# EAGLE design TH555-IO (EAGLE 7.5.0)
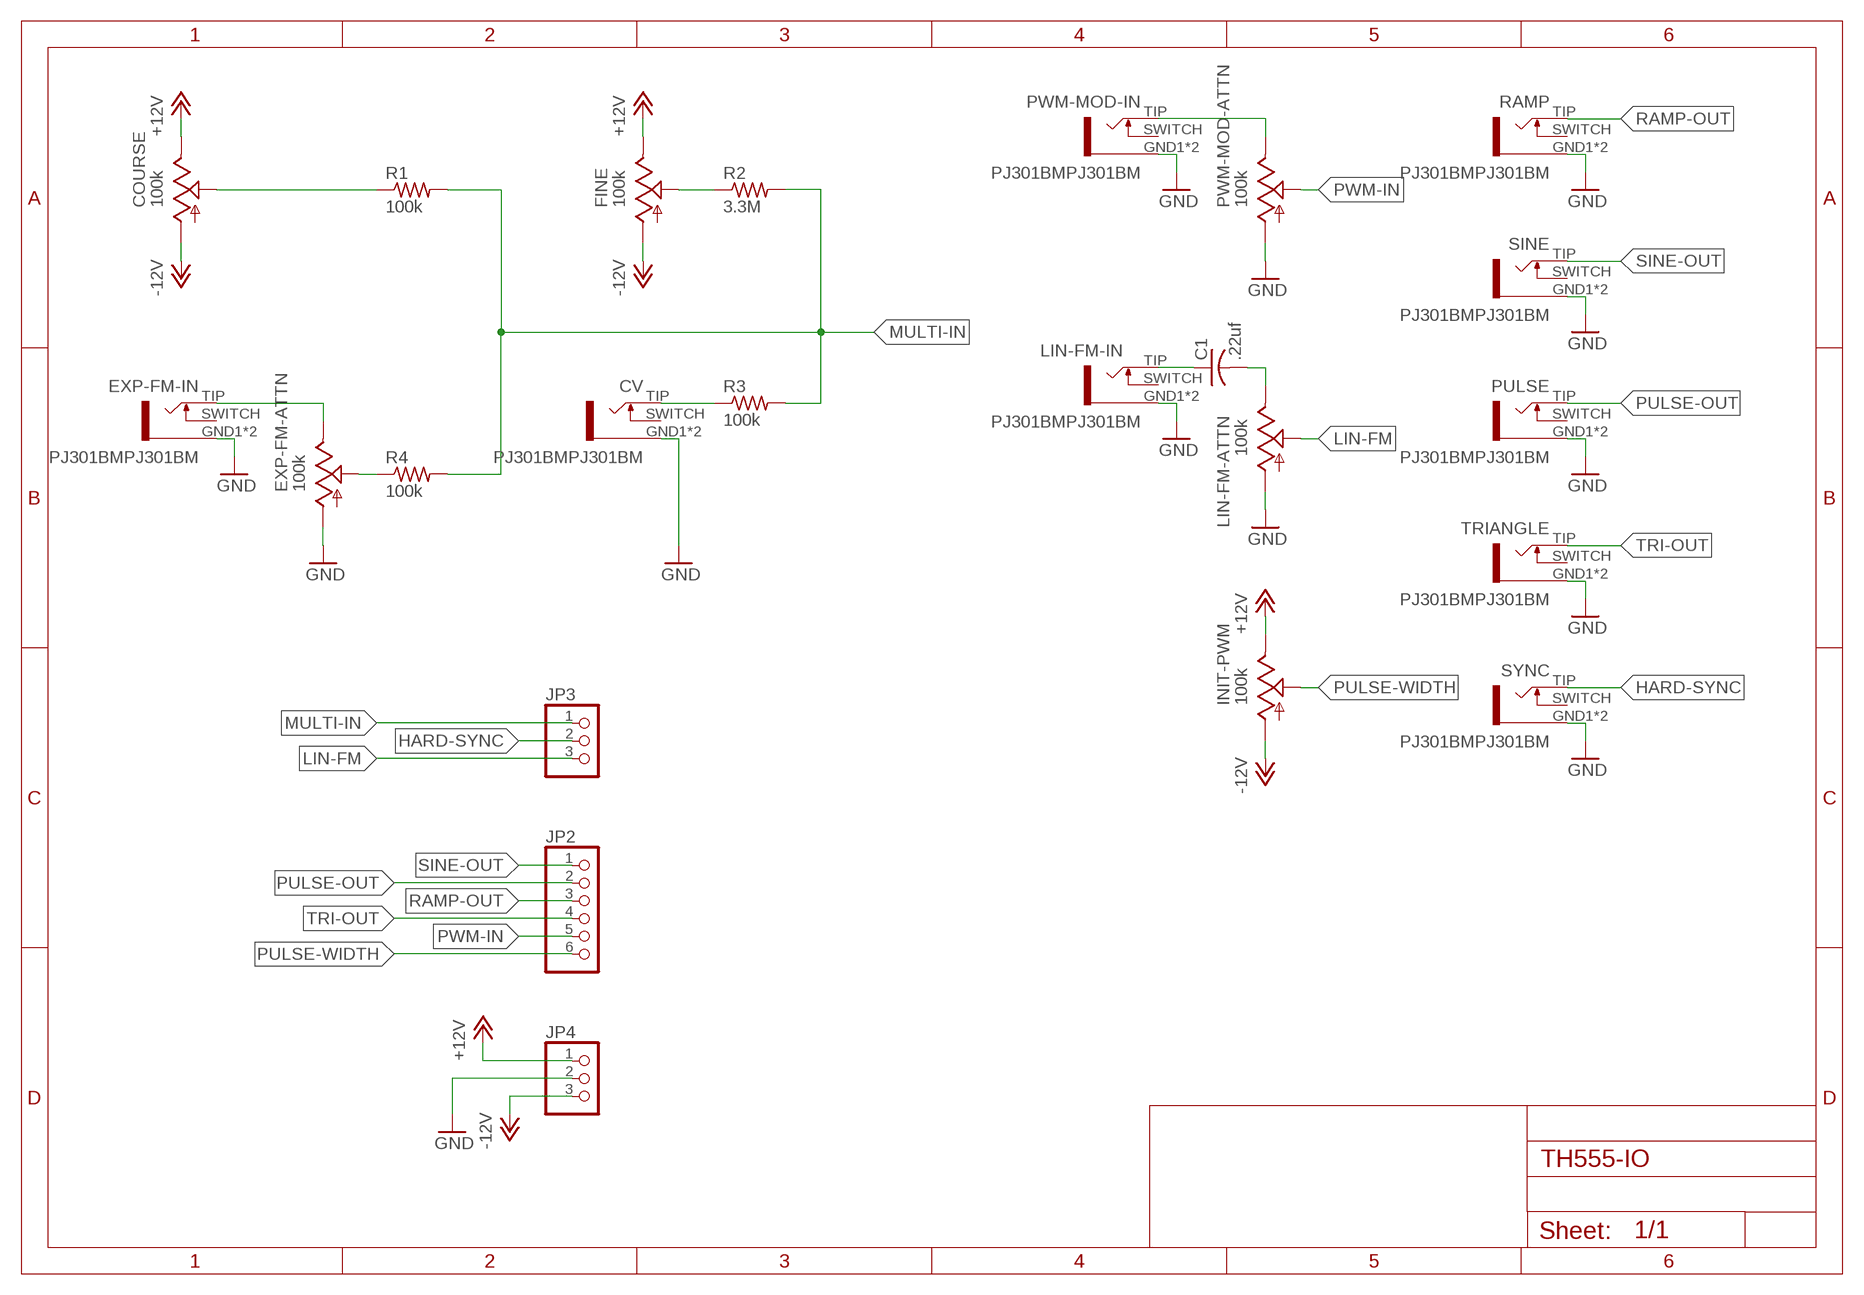
[diagram p0: schematic, sheet 1]

## Parts
C1  .22uf  C-US050-024X044  [C050-024X044]
COURSE  100k  ALPHA-9MMA  [EVUF]
CV  PJ301BMPJ301BM  [PJ301BM]
EXP-FM-ATTN  100k  ALPHA-9MMA  [EVUF]
EXP-FM-IN  PJ301BMPJ301BM  [PJ301BM]
FINE  100k  ALPHA-9MMA  [EVUF]
INIT-PWM  100k  ALPHA-9MMA  [EVUF]
JP2  PINHD-1X6  [1X06]
JP3  PINHD-1X3  [1X03]
JP4  PINHD-1X3  [1X03]
LIN-FM-ATTN  100k  ALPHA-9MMA  [EVUF]
LIN-FM-IN  PJ301BMPJ301BM  [PJ301BM]
PULSE  PJ301BMPJ301BM  [PJ301BM]
PWM-MOD-ATTN  100k  ALPHA-9MMA  [EVUF]
PWM-MOD-IN  PJ301BMPJ301BM  [PJ301BM]
R1  100k  R-US_0207/10  [0207/10]
R2  3.3M  R-US_0207/10  [0207/10]
R3  100k  R-US_0207/10  [0207/10]
R4  100k  R-US_0207/10  [0207/10]
RAMP  PJ301BMPJ301BM  [PJ301BM]
SINE  PJ301BMPJ301BM  [PJ301BM]
SYNC  PJ301BMPJ301BM  [PJ301BM]
TRIANGLE  PJ301BMPJ301BM  [PJ301BM]

## Nets
1V/OCT: CV.TIP R3.1
+12V: COURSE.3(E) FINE.3(E) INIT-PWM.3(E) JP4.1
-12V: COURSE.1(A) FINE.1(A) INIT-PWM.1(A) JP4.3
COARSE: COURSE.2(S) R1.1
EXP-FM: EXP-FM-ATTN.3(E) EXP-FM-IN.TIP
EXP-FM-ATTN: EXP-FM-ATTN.2(S) R4.1
FINE: FINE.2(S) R2.1
GND: CV.GND1 CV.GND2 EXP-FM-ATTN.1(A) EXP-FM-IN.GND1 EXP-FM-IN.GND2 JP4.2 LIN-FM-ATTN.1(A) LIN-FM-IN.GND1 LIN-FM-IN.GND2 PULSE.GND1 PULSE.GND2 PWM-MOD-ATTN.1(A) PWM-MOD-IN.GND1 PWM-MOD-IN.GND2 RAMP.GND1 RAMP.GND2 SINE.GND1 SINE.GND2 SYNC.GND1 SYNC.GND2 TRIANGLE.GND1 TRIANGLE.GND2
HARD-SYNC: JP3.2 SYNC.TIP
LIN-FM: JP3.3 LIN-FM-ATTN.2(S)
MULTI-IN: JP3.1 R1.2 R2.2 R3.2 R4.2
N$2: PWM-MOD-ATTN.3(E) PWM-MOD-IN.TIP
N$6: C1.2 LIN-FM-ATTN.3(E)
N$8: C1.1 LIN-FM-IN.TIP
PULSE-OUT: JP2.2 PULSE.TIP
PULSE-WIDTH: INIT-PWM.2(S) JP2.6
PWM-IN: JP2.5 PWM-MOD-ATTN.2(S)
RAMP-OUT: JP2.3 RAMP.TIP
SINE-OUT: JP2.1 SINE.TIP
TRI-OUT: JP2.4 TRIANGLE.TIP
Unconnected: CV.SWITCH EXP-FM-IN.SWITCH LIN-FM-IN.SWITCH PULSE.SWITCH PWM-MOD-IN.SWITCH RAMP.SWITCH SINE.SWITCH SYNC.SWITCH TRIANGLE.SWITCH

## Library data of the parts
C1 = resistor:C-US: CAPACITOR, American symbol
COURSE EXP-FM-ATTN FINE INIT-PWM LIN-FM-ATTN PWM-MOD-ATTN = TomW:ALPHA-9MM: 9 mm Square Rotary Potentiometers Source: Panasonic
CV EXP-FM-IN LIN-FM-IN PULSE PWM-MOD-IN RAMP SINE SYNC TRIANGLE = gerbster:PJ301BM
JP2 = pinhead:PINHD-1X6: PIN HEADER
JP3 JP4 = pinhead:PINHD-1X3: PIN HEADER
R1-R4 = resistor:R-US_: RESISTOR, American symbol

## Board
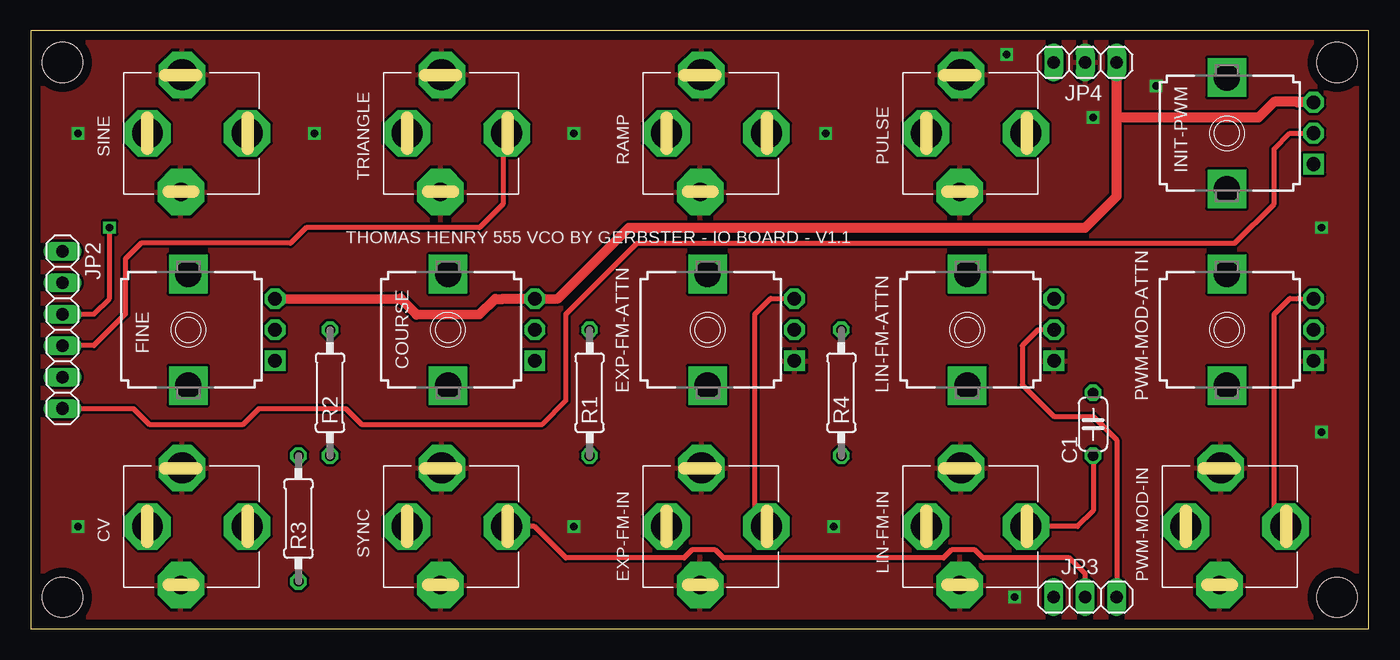
[diagram p1: board, top side]
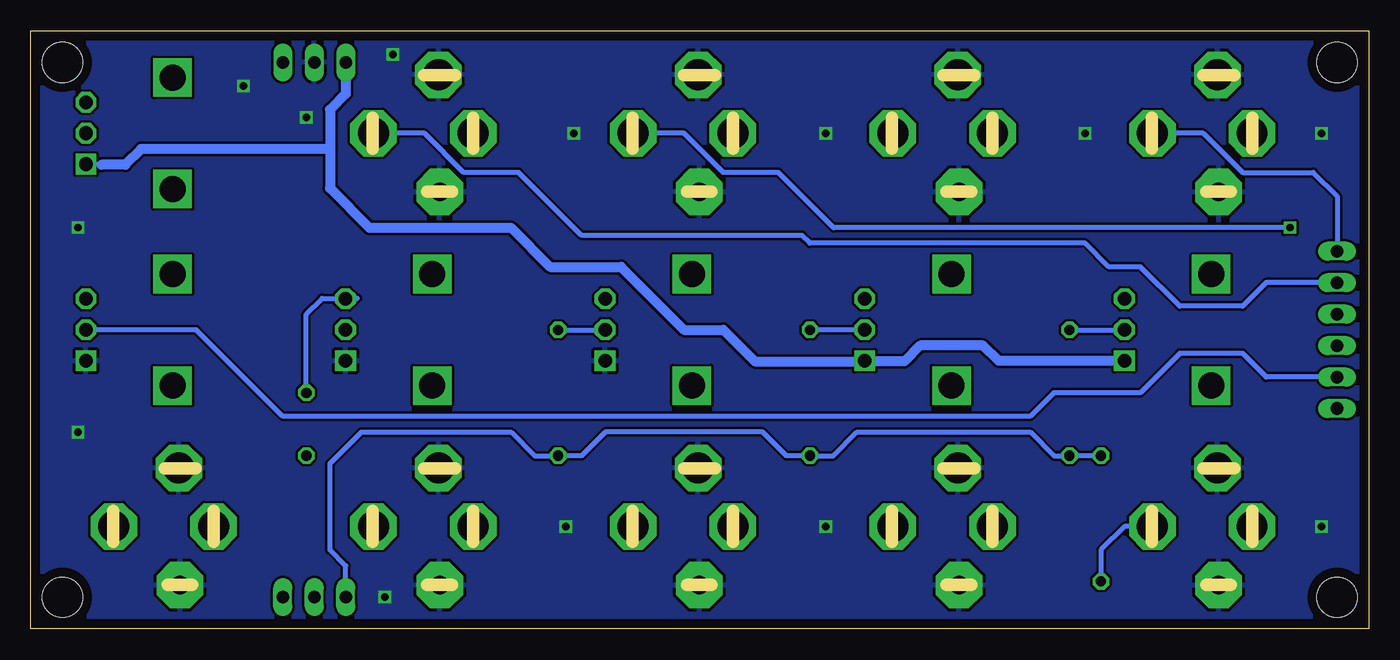
[diagram p2: board, bottom side, seen from below]

Size 107.95 x 48.26 mm. Coordinates in mm from the lower left corner, seen from the top.
Outline: 107.95,0 107.95,48.26 0,48.26 0,0 107.95,0
Copper layers (1*16): Top 0.035mm / dielectric 1.5mm / Bottom 0.035mm
Design rules "PCBWay": minimum track width 10mil, minimum drill 6mil, track to track 8mil, track to pad 8mil, pad to pad 8mil, via to via 8mil, smd to smd 8mil, copper to edge 30mil, drill to drill 8mil, minimum pad ring 10mil, minimum via ring 8mil, stop-mask expansion 4mil, vias tented up to drill 0mil, thermal gap 10mil
Holes 3.21 mm at 2.54,45.72 2.54,2.54 105.41,2.54 105.41,45.72

### Footprints (pad centres in the part's own frame; a part is rotated, then mirrored left to right if it is on the bottom)
C050-024X044 = drill 0.813 octagon: 1 -2.54,0; 2 2.54,0
EVUF = drill 1.1 pad 1.676 square: 1 -2.5,-7 | drill 1.1 pad 1.676 octagon: 2 0,-7; 3 2.5,-7 | drill 2.1 pad 2.8 square: M1 4.5,0; M2 -4.5,0
PJ301BM = drill 2.5 pad 3.75 octagon: GND1 -4.719,-0.5; SWITCH 0,-3.3; TIP 0,4.746 | drill 1.5 pad 3.75 octagon: GND2 4.746,-0.6
1X06 = drill 1.016 long: 1 -6.35,0; 2 -3.81,0; 3 -1.27,0; 4 1.27,0; 5 3.81,0; 6 6.35,0
1X03 = drill 1.016 long: 1 -2.54,0; 2 0,0; 3 2.54,0
0207/10 = drill 0.813 octagon: 1 -5.08,0; 2 5.08,0

### Placement (x,y rotation side)
C1  85.72,16.51 90 top
COURSE  33.66,24.13 90 top
CV  12.7,8.26 270 top
EXP-FM-ATTN  54.61,24.13 90 top
EXP-FM-IN  54.61,8.26 270 top
FINE  12.7,24.13 90 top
INIT-PWM  96.52,40.01 90 top
JP2  2.54,24.13 270 top
JP3  85.09,2.54 0 top
JP4  85.09,45.72 180 top
LIN-FM-ATTN  75.56,24.13 90 top
LIN-FM-IN  75.56,8.26 270 top
PULSE  75.56,40.01 270 top
PWM-MOD-ATTN  96.52,24.13 90 top
PWM-MOD-IN  96.52,8.26 270 top
R1  45.09,19.05 270 top
R2  24.13,19.05 270 top
R3  21.59,8.89 90 top
R4  65.41,19.05 270 top
RAMP  54.61,40.01 270 top
SINE  12.7,40.01 270 top
SYNC  33.66,8.26 270 top
TRIANGLE  33.66,40.01 270 top

### Tracks (layer width: path | path; a pad name or v marks a point on that pad's centre or on a via)
1V/OCT
  Bottom 0.406: CV.TIP 19.68,8.26 21.59,6.35 R3.1
+12V
  Top 0.813: INIT-PWM.3 102.23,42.51 102.23,42.55 100.33,42.55 99.06,41.27 87.63,41.27 | FINE.3 29.84,26.67 31.11,25.36 36.2,25.4 37.47,26.63 38.1,26.63 | COURSE.3 38.1,26.63 | 38.1,26.63 42.55,26.67 48.26,32.38 85.09,32.38 87.63,34.92 87.63,41.27 | 87.63,41.27 JP4.1
-12V
  Bottom 0.406: 102.25,37.47 INIT-PWM.1 | 40.34,21.59 COURSE.1
  Bottom 0.813: JP4.3 82.55,43.18 83.82,41.91 83.82,38.73 | 83.82,38.73 99.06,38.73 100.33,37.47 102.25,37.47 | 83.82,38.73 83.82,35.56 80.64,32.38 69.22,32.38 66.04,29.21 60.33,29.21 55.24,24.13 52.07,24.13 49.53,21.59 40.34,21.59 37.47,21.59 36.2,22.86 31.11,22.86 29.84,21.63 FINE.1
COARSE
  Bottom 0.406: COURSE.2 R1.1
EXP-FM
  Top 0.406: EXP-FM-IN.TIP 58.42,8.89 58.42,25.4 59.69,26.67 60.98,26.67 EXP-FM-ATTN.3
EXP-FM-ATTN
  Bottom 0.406: R4.1 EXP-FM-ATTN.2
FINE
  Bottom 0.406: R2.1 FINE.2
GND  (via drill 0.6)
  other vias: 3.81,8.26 78.74,46.35 79.38,2.54 90.81,43.81 64.14,40.01 64.77,8.26 43.81,8.26 43.81,40.01 22.86,40.01 85.72,41.27 3.81,40.01 104.14,32.38 104.14,15.88
  pour Bottom: 0,48.26 0,0 107.95,0 107.95,48.26
  pour Top: 0,48.26 0,0 107.95,0 107.95,48.26
HARD-SYNC
  Top 0.406: JP3.2 85.09,4.45 83.82,5.71 76.83,5.71 76.2,6.35 74.3,6.35 73.66,5.71 55.88,5.71 55.24,6.35 53.34,6.35 52.7,5.71 43.18,5.71 40.64,8.26 SYNC.TIP
LIN-FM  (1 unrouted)
  Top 0.406: LIN-FM-ATTN.2 81.28,24.13 80.01,22.86 80.01,19.68 82.55,17.14 85.72,17.14 87.63,15.24 JP3.3
MULTI-IN
  Bottom 0.406: R3.2 R2.2 25.4,13.97 27.3,15.88 41.27,15.88 43.18,13.97 R1.2 46.99,13.97 48.9,15.88 61.59,15.88 63.5,13.97 R4.2 67.31,13.97 69.22,15.88 81.28,15.88 83.82,13.34 83.82,6.35 82.55,5.08 JP3.1
N$2
  Top 0.406: PWM-MOD-IN.TIP 100.33,8.89 100.33,25.4 101.6,26.67 102.25,26.67 PWM-MOD-ATTN.3
N$6
  Bottom 0.406: C1.2 85.72,25.4 84.45,26.67 81.61,26.67 LIN-FM-ATTN.3
N$8
  Top 0.406: C1.1 85.72,9.53 84.45,8.26 LIN-FM-IN.TIP
PULSE-OUT
  Bottom 0.406: JP2.2 8.26,27.94 10.16,26.04 15.24,26.04 18.41,29.21 20.95,29.21 22.86,31.11 45.09,31.11 45.72,31.75 63.5,31.75 68.58,36.83 73.03,36.83 76.2,40.01 PULSE.TIP
PULSE-WIDTH
  Top 0.406: JP2.6 8.26,17.78 9.53,16.51 17.14,16.51 18.41,17.78 25.4,17.78 26.67,16.51 41.27,16.51 43.18,18.41 43.18,25.4 48.9,31.11 97.16,31.11 100.33,34.29 100.33,38.73 101.6,40.01 INIT-PWM.2
PWM-IN
  Bottom 0.406: JP2.5 8.26,20.32 10.16,22.23 15.24,22.23 18.41,19.05 25.4,19.05 27.3,17.14 87.63,17.14 94.61,24.13 PWM-MOD-ATTN.2
RAMP-OUT  (via drill 0.6)
  Top 0.406: JP2.3 5.08,25.4 6.35,26.67 v6.35,32.38
  Bottom 0.406: v6.35,32.38 43.18,32.38 47.62,36.83 52.07,36.83 55.24,40.01 RAMP.TIP
SINE-OUT
  Bottom 0.406: JP2.1 2.54,34.92 4.45,36.83 10.16,36.83 13.34,40.01 SINE.TIP
TRI-OUT
  Top 0.406: TRIANGLE.TIP 38.1,40.01 38.1,34.29 36.2,32.38 22.23,32.38 20.95,31.11 8.89,31.11 7.62,29.84 7.62,25.4 5.08,22.86 JP2.4

### Text on the board
tNames: THOMAS HENRY 555 VCO BY GERBSTER - IO BOARD - V1.1